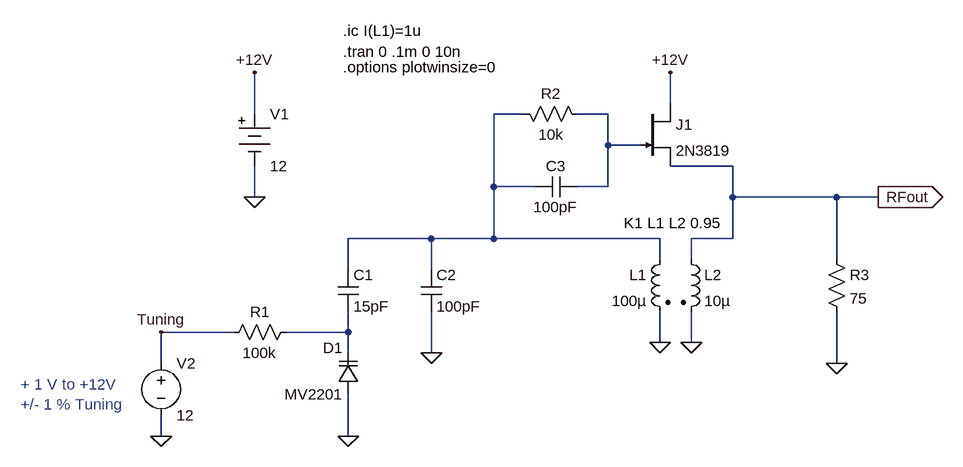
[diagram p0: schematic Voltage Tuned LC Oscillator_1.asc]
Voltage Tuned LC Oscillator_1.asc, the LTspice schematic file:
Version 4
SHEET 1 996 680
WIRE 544 -96 544 -144
WIRE -96 -80 -96 -144
WIRE 320 -80 272 -80
WIRE 448 -80 400 -80
WIRE 448 -32 448 -80
WIRE 496 -32 448 -32
WIRE 640 0 544 0
WIRE 272 32 272 -80
WIRE 336 32 272 32
WIRE 448 32 448 -32
WIRE 448 32 400 32
WIRE -96 48 -96 0
WIRE 640 48 640 0
WIRE 800 48 640 48
WIRE 864 48 800 48
WIRE 176 112 48 112
WIRE 272 112 272 32
WIRE 272 112 176 112
WIRE 528 112 272 112
WIRE 640 112 640 48
WIRE 640 112 576 112
WIRE 528 144 528 112
WIRE 576 144 576 112
WIRE 800 144 800 48
WIRE 48 160 48 112
WIRE 176 160 176 112
WIRE -128 256 -240 256
WIRE 48 256 48 224
WIRE 48 256 -48 256
WIRE 528 272 528 224
WIRE 576 272 576 224
WIRE 48 288 48 256
WIRE 176 288 176 224
WIRE -240 304 -240 256
WIRE 800 304 800 224
WIRE -240 416 -240 384
WIRE 48 416 48 352
FLAG 176 288 0
FLAG 48 416 0
FLAG -240 256 Tuning
FLAG 528 272 0
FLAG 576 272 0
FLAG 544 -144 +12V
FLAG 864 48 RFout
IOPIN 864 48 Out
FLAG -96 48 0
FLAG -96 -144 +12V
FLAG -240 416 0
FLAG 800 304 0
SYMBOL res -144 272 R270
WINDOW 0 32 56 VTop 0
WINDOW 3 0 56 VBottom 0
SYMATTR InstName R1
SYMATTR Value 100k
SYMBOL res 416 -64 M270
WINDOW 0 32 56 VTop 0
WINDOW 3 0 56 VBottom 0
SYMATTR InstName R2
SYMATTR Value 10k
SYMBOL cap 160 160 R0
SYMATTR InstName C2
SYMATTR Value 100pF
SYMBOL cap 400 16 R90
WINDOW 0 0 32 VBottom 0
WINDOW 3 32 32 VTop 0
SYMATTR InstName C3
SYMATTR Value 100pF
SYMBOL varactor 64 352 R180
WINDOW 0 24 72 Left 0
WINDOW 3 24 0 Left 0
SYMATTR InstName D1
SYMATTR Value MV2201
SYMBOL ind2 544 128 M0
SYMATTR InstName L1
SYMATTR Value 100µ
SYMATTR Type ind
SYMBOL ind2 560 128 R0
SYMATTR InstName L2
SYMATTR Value 10µ
SYMATTR Type ind
SYMBOL njf 496 -96 R0
SYMATTR InstName J1
SYMATTR Value 2N3819
SYMBOL Misc\\battery -96 -96 R0
WINDOW 123 0 0 Left 0
WINDOW 39 0 0 Left 0
SYMATTR InstName V1
SYMATTR Value 12
SYMBOL voltage -240 288 R0
WINDOW 123 0 0 Left 0
WINDOW 39 0 0 Left 0
SYMATTR InstName V2
SYMATTR Value 12
SYMBOL res 784 128 R0
SYMATTR InstName R3
SYMATTR Value 75
SYMBOL cap 32 160 R0
SYMATTR InstName C1
SYMATTR Value 15pF
TEXT 472 88 Left 0 !K1 L1 L2 0.95
TEXT -456 336 Left 0 ;+ 1 V to +12V\n+/- 1 % Tuning
TEXT 40 -176 Left 0 !.tran 0 .1m 0 10n
TEXT 40 -208 Left 0 !.ic I(L1)=1u
TEXT 40 -152 Left 0 !.options plotwinsize=0

The netlist it stands for:
* Voltage Tuned LC Oscillator_1.asc
R1 Tuning N003 100k
R2 N002 N001 10k
C2 N001 0 100pF
C3 N002 N001 100pF
D1 0 N003 MV2201
L1 N001 0 100µ
L2 RFout 0 10µ
J1 +12V N002 RFout 2N3819
V1 +12V 0 12
V2 Tuning 0 12
R3 RFout 0 75
C1 N001 N003 15pF
.model D D
.lib standard.dio
.model NJF NJF
.model PJF PJF
.lib standard.jft
K1 L1 L2 0.95
* + 1 V to +12V
* +/- 1 % Tuning
.tran 0 .1m 0 10n
.ic I(L1)=1u
.options plotwinsize=0
.backanno
.end